# EAGLE design DMClock2018_GPS (EAGLE 5.12)
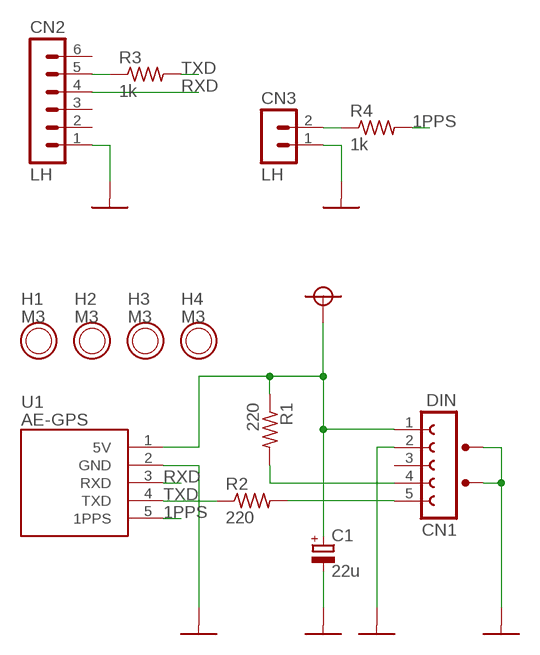
[diagram p0: schematic, sheet 1]

## Parts
C1  22u  CPOL'5MM_2MM'  [CPOL_5MM_2MM]
CN1  DIN  DIN05_F2'KDJ03'  [KDJ03-5]
CN2  LH  MA06'L'  [MA06L]
CN3  LH  MA02'L'  [MA02L]
H1  M3  H'M3'  [H_M3]
H2  M3  H'M3'  [H_M3]
H3  M3  H'M3'  [H_M3]
H4  M3  H'M3'  [H_M3]
R1  220  R'300MIL'  [R_300MIL]
R2  220  R'300MIL'  [R_300MIL]
R3  1k  R'300MIL'  [R_300MIL]
R4  1k  R'300MIL'  [R_300MIL]
U1  AE-GPS  [AE-GPS]

## Nets
1PPS: R4.2 U1.5(1PPS)
+5V: C1.+ CN1.1 R1.1 U1.1(5V) ; supply symbol labelled V+
GND: C1.- CN1.2 CN1.F1 CN1.F2 CN2.1 CN3.1 U1.2(GND)
N$1: CN2.5 R3.1
N$3: CN1.5 R2.2
N$5: CN1.4 R1.2
N$10: CN3.2 R4.1
RXD: CN2.4 U1.3(RXD)
TXD: R2.1 R3.2 U1.4(TXD)
Unconnected: CN1.3 CN2.2 CN2.3 CN2.6

## Library data of the parts
C1 = DMClock2018:CPOL: Capacitor, polarized
CN1 = DMClock2018:DIN05_F2: DIN connector, 5 poles, with 2 frame poles
CN2 = DMClock2018:MA06: Male header, 6 poles
CN3 = DMClock2018:MA02: Male header, 2 poles
H1-H4 = DMClock2018:H: Unmasked PCB hole
R1-R4 = DMClock2018:R: Resistor
U1 = DMClock2018:AE-GPS: Akizuki Denshi GYSFDMAXB GPS receiver module

## Board
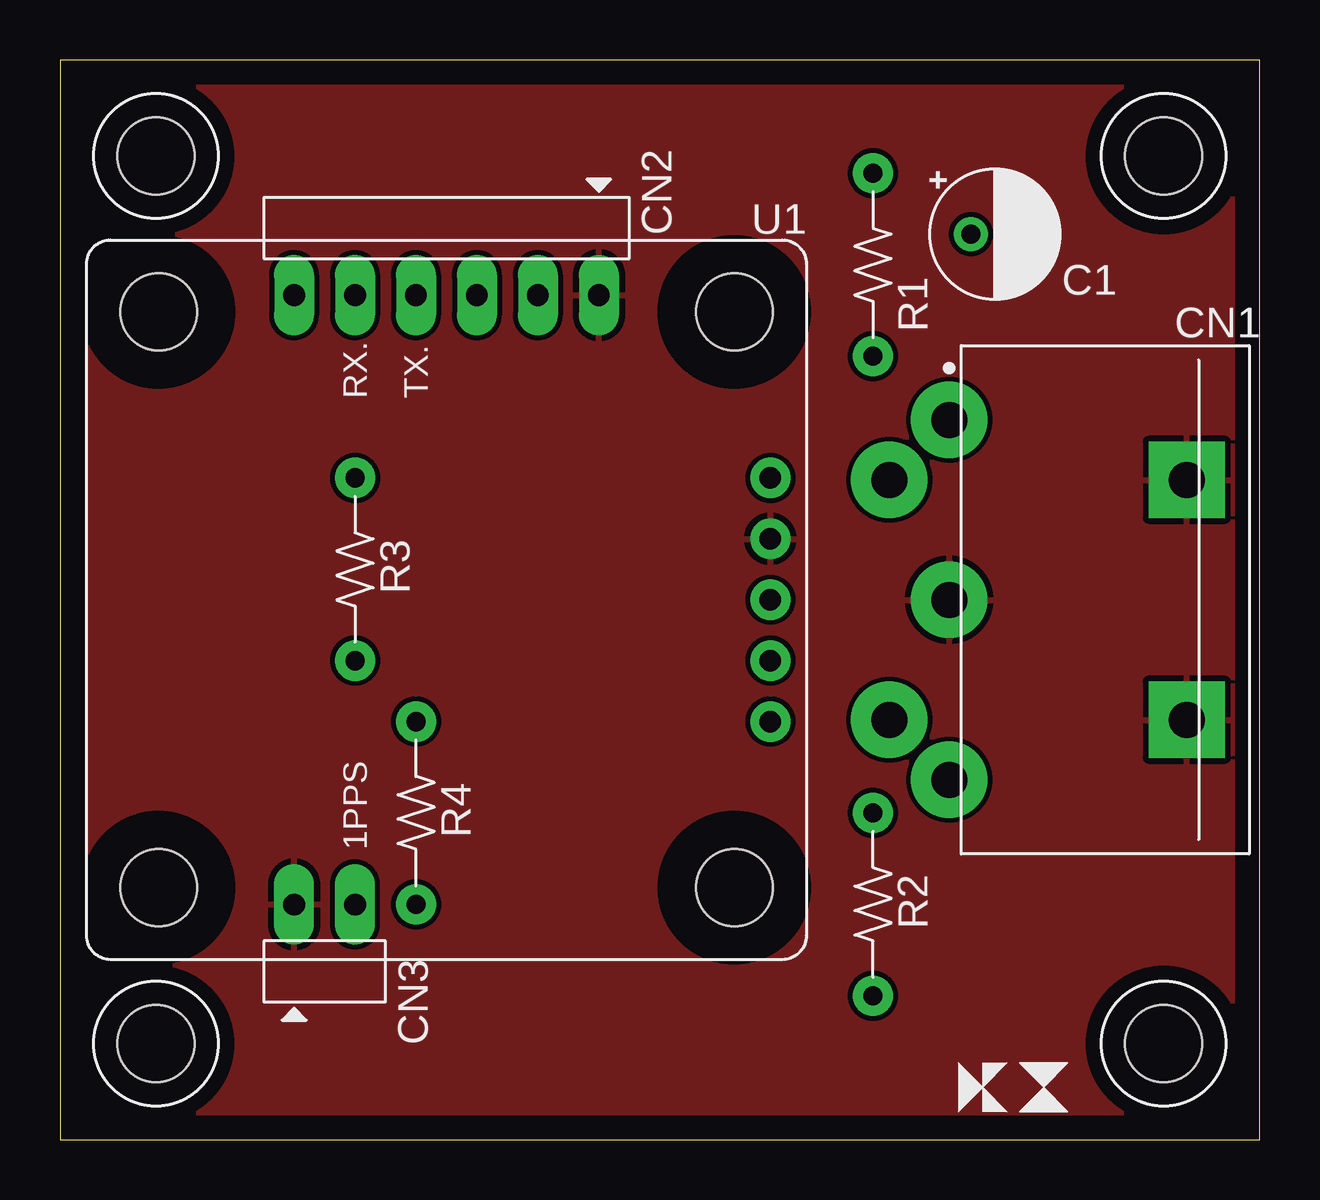
[diagram p1: board, top side]
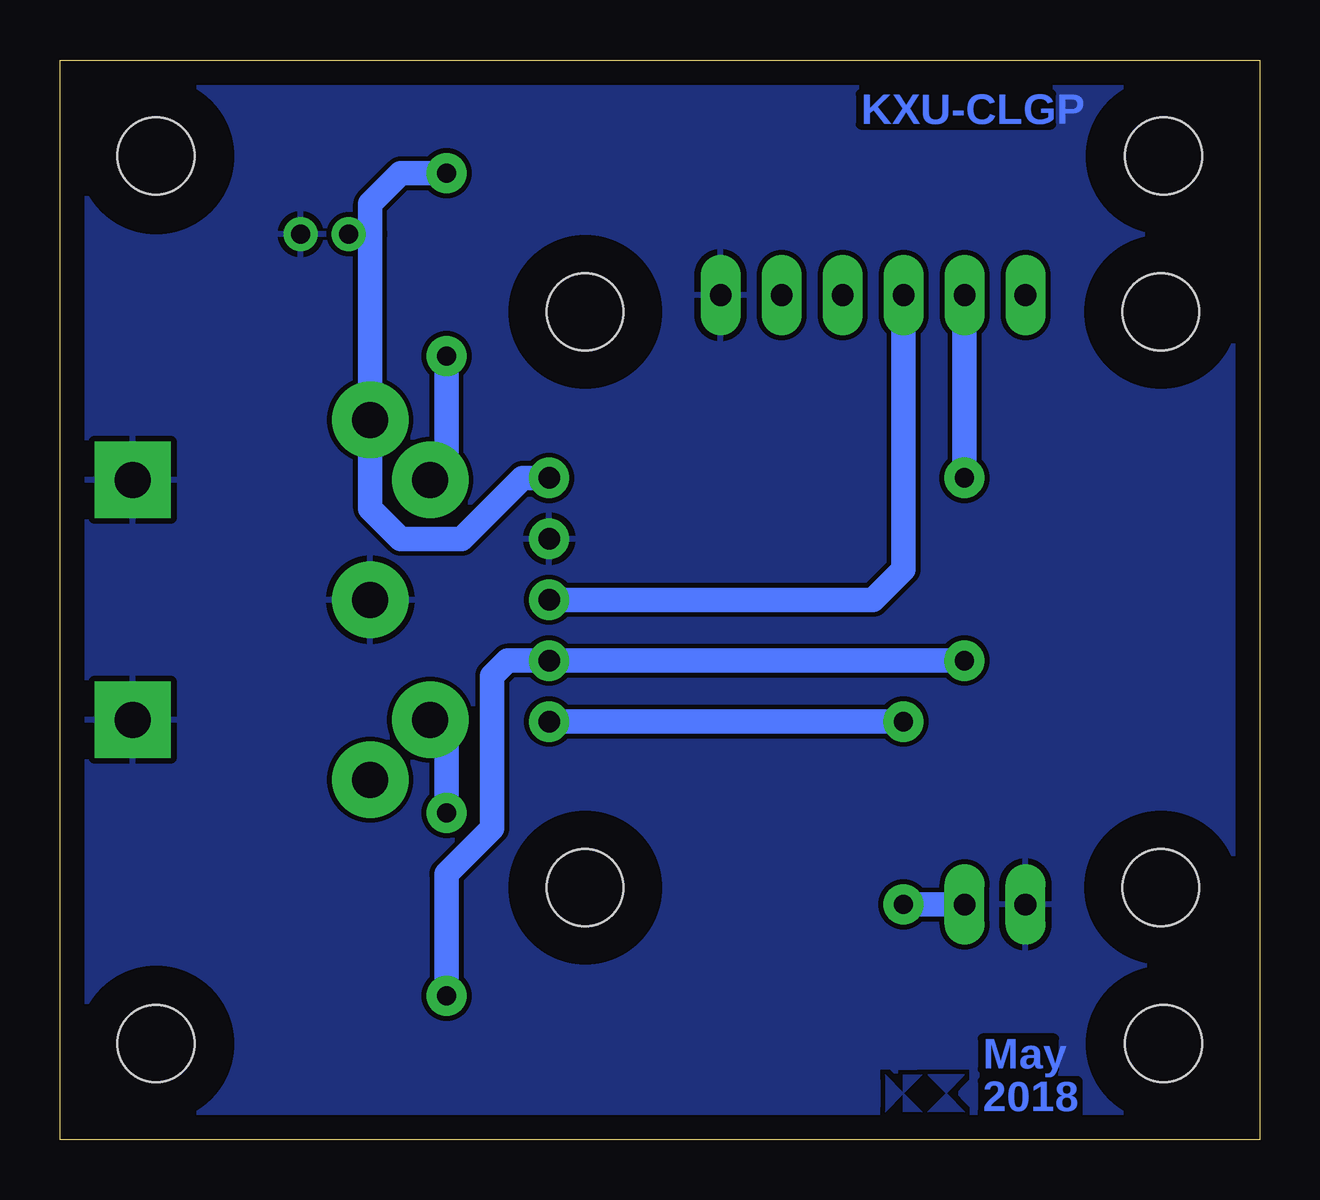
[diagram p2: board, bottom side, seen from below]

Size 50 x 45 mm. Coordinates in mm from the lower left corner, seen from the top.
Outline: 0,0 50,0 50,45 0,45 0,0
Copper layers (1*16): Top 0.035mm / dielectric 1.5mm / Bottom 0.035mm
Design rules "default": minimum track width 10mil, minimum drill 24mil, track to track 8mil, track to pad 8mil, pad to pad 8mil, via to via 8mil, smd to smd 8mil, copper to edge 40mil, drill to drill 8mil, minimum pad ring 10mil, minimum via ring 8mil, stop-mask expansion 4mil, vias tented up to drill 0mil, thermal gap 10mil

### Footprints (pad centres in the part's own frame; a part is rotated, then mirrored left to right if it is on the bottom)
CPOL_5MM_2MM = drill 0.8 pad 1.422 round: + -1,0; - 1,0
KDJ03-5 = drill 1.5 pad 3.175 round: 1 -7.5,0; 2 0,0; 3 7.5,0; 4 -5,-2.5; 5 5,-2.5 | drill 1.5 pad 3.175 square: F1 -5,9.9; F2 5,9.9
MA06L = drill 0.9 pad 1.676 long: 1 -6.35,0; 2 -3.81,0; 3 -1.27,0; 4 1.27,0; 5 3.81,0; 6 6.35,0
MA02L = drill 0.9 pad 1.676 long: 1 -1.27,0; 2 1.27,0
H_M3 = hole 3.2: 0,0
R_300MIL = drill 0.8 pad 1.676 round: 1 -3.81,0; 2 3.81,0
AE-GPS = drill 0.9 pad 1.676 round: 1 13.5,5.08; 2 13.5,2.54; 3 13.5,0; 4 13.5,-2.54; 5 13.5,-5.08 | hole 3.2: 12,12; -12,12; 12,-12; -12,-12

### Placement (x,y rotation side)
C1  38.97,37.74 0 top
CN1  37.06,22.5 270 top
CN2  16.11,35.2 180 top
CN3  11.03,9.8 0 top
H1  4,41 0 top
H2  46,41 0 top
H3  46,4 0 top
H4  4,4 0 top
R1  33.89,36.47 270 top
R2  33.89,9.8 90 top
R3  12.3,23.77 270 top
R4  14.84,13.61 90 top
U1  16.11,22.5 0 top

### Tracks (layer width: path | path; a pad name or v marks a point on that pad's centre or on a via)
1PPS
  Bottom 1.016: U1.5 R4.2
+5V
  Bottom 1.016: U1.1 30.71,27.58 33.26,25.04 35.8,25.04 37.06,26.31 CN1.1 37.06,37.74 | R1.1 35.8,40.28 37.06,39.01 37.06,37.74 | 37.06,37.74 C1.+
GND
  pour Bottom (rank 2): 1,44 49,44 49,1 1,1
  pour Top (rank 2): 1,44 49,44 49,1 1,1
N$1
  Bottom 1.016: CN2.5 R3.1
N$3
  Bottom 1.016: R2.2 33.89,16.82 CN1.5
N$5
  Bottom 1.016: R1.2 33.89,28.18 CN1.4
N$10
  Bottom 1.016: R4.1 CN3.2
N$20
  pour Bottom: 12.3,1.16 13.82,1.16 13.06,1.93
N$22
  pour Bottom: 13.06,1.93 12.3,2.69 13.82,2.69
N$33
  pour Bottom: 14.08,2.69 14.84,1.93 14.84,2.69
N$40
  pour Bottom: 14.84,1.93 14.08,1.16 14.84,1.16
N$43
  pour Bottom: 14.84,1.93 15.6,2.69 15.6,1.16
RXD
  Bottom 1.016: U1.3 16.11,22.5 14.84,23.77 CN2.4
TXD
  Bottom 1.016: R2.1 33.89,11.07 31.98,12.97 31.98,19.32 31.35,19.96 U1.4 R3.2

### Text on the board
Bottom: KXU-CLGP | May | 2018
tNames: + | RX. | TX. | 1PPS